# Altium schematic sheet GPIO.SchDoc: APTOMAT - Power Supply
size A4; Revision: 1.1.1; SheetNumber: 5; SheetTotal: 5; DrawnBy: KJP; ProjectNumber: 4397; PCBRevision: 0071KJP; DocumentSize: A4; PCAName: PCA10040; PCBNumber: 400150; ProjectName: Quark
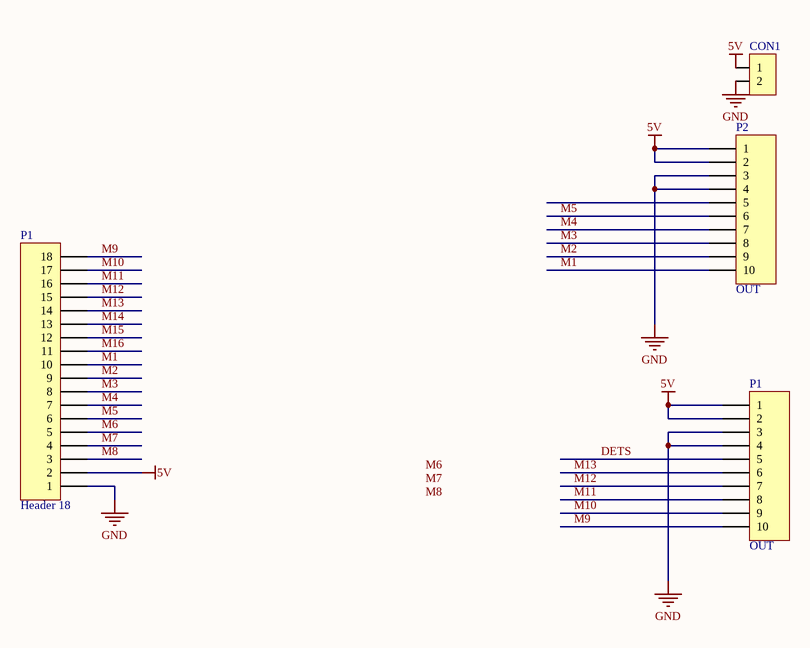
[diagram p0: GPIO.SchDoc]

## Parts
(Parts that share a designator on the sheet are numbered #1, #2 ... from top to bottom, then left to right.)
CON1  CON 2 KF301_MH  [CON 2 KF301]  (value not drawn)
P1#1  OUT  [JST-PH2.00-10P]
P1#2  Header 18  [Convert_pcb]
P2  OUT  [JST-PH2.00-10P]

## Nets
5V: CON1.1 P1#1.1 P1#1.2 P1#2.2 P2.1 P2.2
GND: CON1.2 P1#1.3 P1#1.4 P1#2.1 P2.3 P2.4
DETS: P1#1.5
M1: P1#2.10 P2.10
M2: P1#2.9 P2.9
M3: P1#2.8 P2.8
M4: P1#2.7 P2.7
M5: P1#2.6 P2.6
M6: P1#2.5
M7: P1#2.4
M8: P1#2.3
M9: P1#1.10 P1#2.18
M10: P1#1.9 P1#2.17
M11: P1#1.8 P1#2.16
M12: P1#1.7 P1#2.15
M13: P1#1.6 P1#2.14
M14: P1#2.13
M15: P1#2.12
M16: P1#2.11

Not connected (* = marked no-connect by the designer): P2 5

## Notes on the sheet
- Labels drawn without touching a wire or pin: M6, M7, M8

## Library data of the parts
CON1 = CON 2 KF301_MH: CON 2 KF301, 5.08mm
P1#1 P2 = Header 10: Header, 10-Pin; LatestRevisionDate: 17-Jul-2002; LatestRevisionNote: Re-released for DXP Platform.; Publisher: Altium Limited
P1#2 = Header 18: Header, 18-Pin; LatestRevisionDate: 17-Jul-2002; LatestRevisionNote: Re-released for DXP Platform.; Publisher: Altium Limited